# EAGLE design TSOP-Customized (EAGLE 9.0.1)
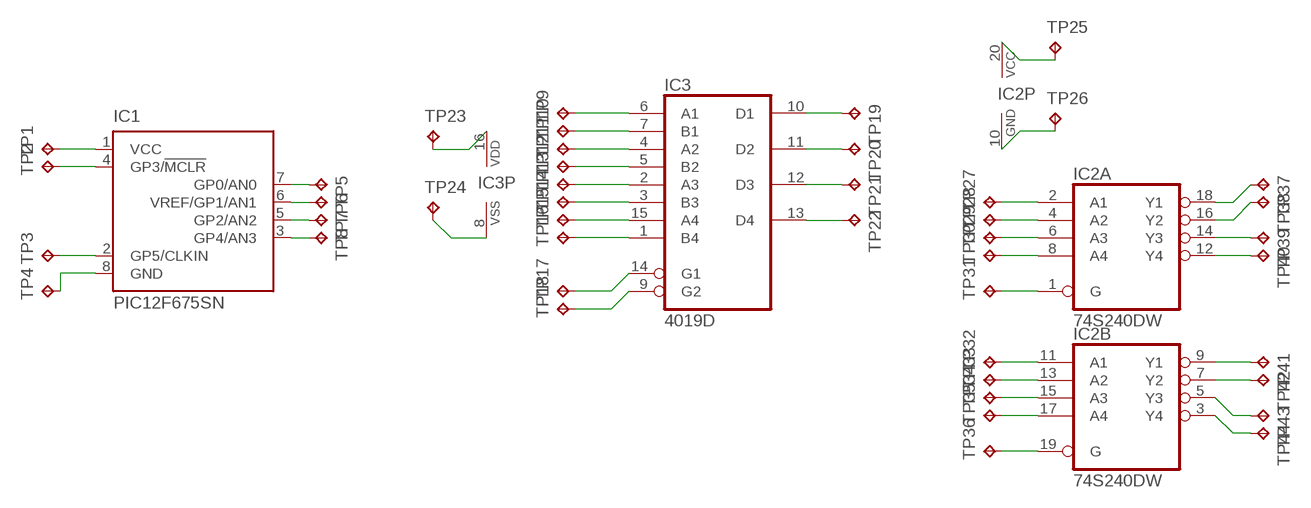
[diagram p0: schematic, sheet 1]

## Parts
IC1  PIC12F675SN  [SO-08]
IC2  74S240DW  [SO20W]
IC3  4019D  [SO16]
TP1  TPPAD1-13Y  [P1-13Y]
TP2  TPPAD1-13Y  [P1-13Y]
TP3  TPPAD1-13Y  [P1-13Y]
TP4  TPPAD1-13Y  [P1-13Y]
TP5  TPPAD1-13Y  [P1-13Y]
TP6  TPPAD1-13Y  [P1-13Y]
TP7  TPPAD1-13Y  [P1-13Y]
TP8  TPPAD1-13Y  [P1-13Y]
TP9  TPPAD1-13Y  [P1-13Y]
TP10  TPPAD1-13Y  [P1-13Y]
TP11  TPPAD1-13Y  [P1-13Y]
TP12  TPPAD1-13Y  [P1-13Y]
TP13  TPPAD1-13Y  [P1-13Y]
TP14  TPPAD1-13Y  [P1-13Y]
TP15  TPPAD1-13Y  [P1-13Y]
TP16  TPPAD1-13Y  [P1-13Y]
TP17  TPPAD1-13Y  [P1-13Y]
TP18  TPPAD1-13Y  [P1-13Y]
TP19  TPPAD1-13Y  [P1-13Y]
TP20  TPPAD1-13Y  [P1-13Y]
TP21  TPPAD1-13Y  [P1-13Y]
TP22  TPPAD1-13Y  [P1-13Y]
TP23  TPPAD1-13Y  [P1-13Y]
TP24  TPPAD1-13Y  [P1-13Y]
TP25  TPPAD1-13Y  [P1-13Y]
TP26  TPPAD1-13Y  [P1-13Y]
TP27  TPPAD1-13Y  [P1-13Y]
TP28  TPPAD1-13Y  [P1-13Y]
TP29  TPPAD1-13Y  [P1-13Y]
TP30  TPPAD1-13Y  [P1-13Y]
TP31  TPPAD1-13Y  [P1-13Y]
TP32  TPPAD1-13Y  [P1-13Y]
TP33  TPPAD1-13Y  [P1-13Y]
TP34  TPPAD1-13Y  [P1-13Y]
TP35  TPPAD1-13Y  [P1-13Y]
TP36  TPPAD1-13Y  [P1-13Y]
TP37  TPPAD1-13Y  [P1-13Y]
TP38  TPPAD1-13Y  [P1-13Y]
TP39  TPPAD1-13Y  [P1-13Y]
TP40  TPPAD1-13Y  [P1-13Y]
TP41  TPPAD1-13Y  [P1-13Y]
TP42  TPPAD1-13Y  [P1-13Y]
TP43  TPPAD1-13Y  [P1-13Y]
TP44  TPPAD1-13Y  [P1-13Y]

## Nets
N$1: IC1.1(VCC) TP1.TP
N$2: IC1.4(GP3/!MCLR) TP2.TP
N$3: IC1.2(GP5/CLKIN) TP3.TP
N$4: IC1.8(GND) TP4.TP
N$5: IC1.3(GP4/AN3) TP8.TP
N$6: IC1.5(GP2/AN2) TP7.TP
N$7: IC1.6(VREF/GP1/AN1) TP6.TP
N$8: IC1.7(GP0/AN0) TP5.TP
N$9: IC3.6(A1) TP9.TP
N$10: IC3.7(B1) TP10.TP
N$11: IC3.4(A2) TP11.TP
N$12: IC3.5(B2) TP12.TP
N$13: IC3.2(A3) TP13.TP
N$14: IC3.3(B3) TP14.TP
N$15: IC3.15(A4) TP15.TP
N$16: IC3.1(B4) TP16.TP
N$17: IC3.14(G1) TP17.TP
N$18: IC3.9(G2) TP18.TP
N$19: IC3.13(D4) TP22.TP
N$20: IC3.12(D3) TP21.TP
N$21: IC3.11(D2) TP20.TP
N$22: IC3.10(D1) TP19.TP
N$23: IC3.8(VSS) TP24.TP
N$24: IC3.16(VDD) TP23.TP
N$25: IC2.2(A:A1) TP27.TP
N$26: IC2.4(A:A2) TP28.TP
N$27: IC2.6(A:A3) TP29.TP
N$28: IC2.8(A:A4) TP30.TP
N$29: IC2.1(A:G) TP31.TP
N$30: IC2.11(B:A1) TP32.TP
N$31: IC2.13(B:A2) TP33.TP
N$32: IC2.15(B:A3) TP34.TP
N$33: IC2.17(B:A4) TP35.TP
N$34: IC2.19(B:G) TP36.TP
N$35: IC2.20(P:VCC) TP25.TP
N$36: IC2.10(P:GND) TP26.TP
N$37: IC2.18(A:Y1) TP37.TP
N$38: IC2.16(A:Y2) TP38.TP
N$39: IC2.14(A:Y3) TP39.TP
N$40: IC2.12(A:Y4) TP40.TP
N$41: IC2.9(B:Y1) TP41.TP
N$42: IC2.7(B:Y2) TP42.TP
N$43: IC2.5(B:Y3) TP43.TP
N$44: IC2.3(B:Y4) TP44.TP

## Library data of the parts
IC1 = microchip:PIC12F675: 8-Pin FLASH-Based 8-Bit CMOS Microcontroller Precision Internal 4 MHz oscillator factory calibrated to ±1% Low Power Features: Standby Current: - 1 nA @ 2.0V, typical Operating Current: - 8.5µA @ 32 kHz, 2.0V, typical - 100µA @ 1 MHz, 2.0V, typical Watchdog Timer Current: - 300 nA @ 2.0V, typical Timer1 oscillator current: - 4µA @ 32 kHz, 2.0V, typical Analog-to-Digital Converter module: - 10-bit resolution - Programmable 4-channel input - Voltage reference input Source: http://www.microchip.com .. 41190E.pdf; MF: MICROCHIP; MPN: PIC12F675-E/SN; OC_FARNELL: 9759026; OC_NEWARK: 92C4341
IC2 = 74xx-eu:74*240: Octal BUFFER and LINE DRIVER, 3-state
IC3 = 40xx:4019: Quad AND-OR select gate
TP1-TP44 = testpad:TP: Test pad

## Board
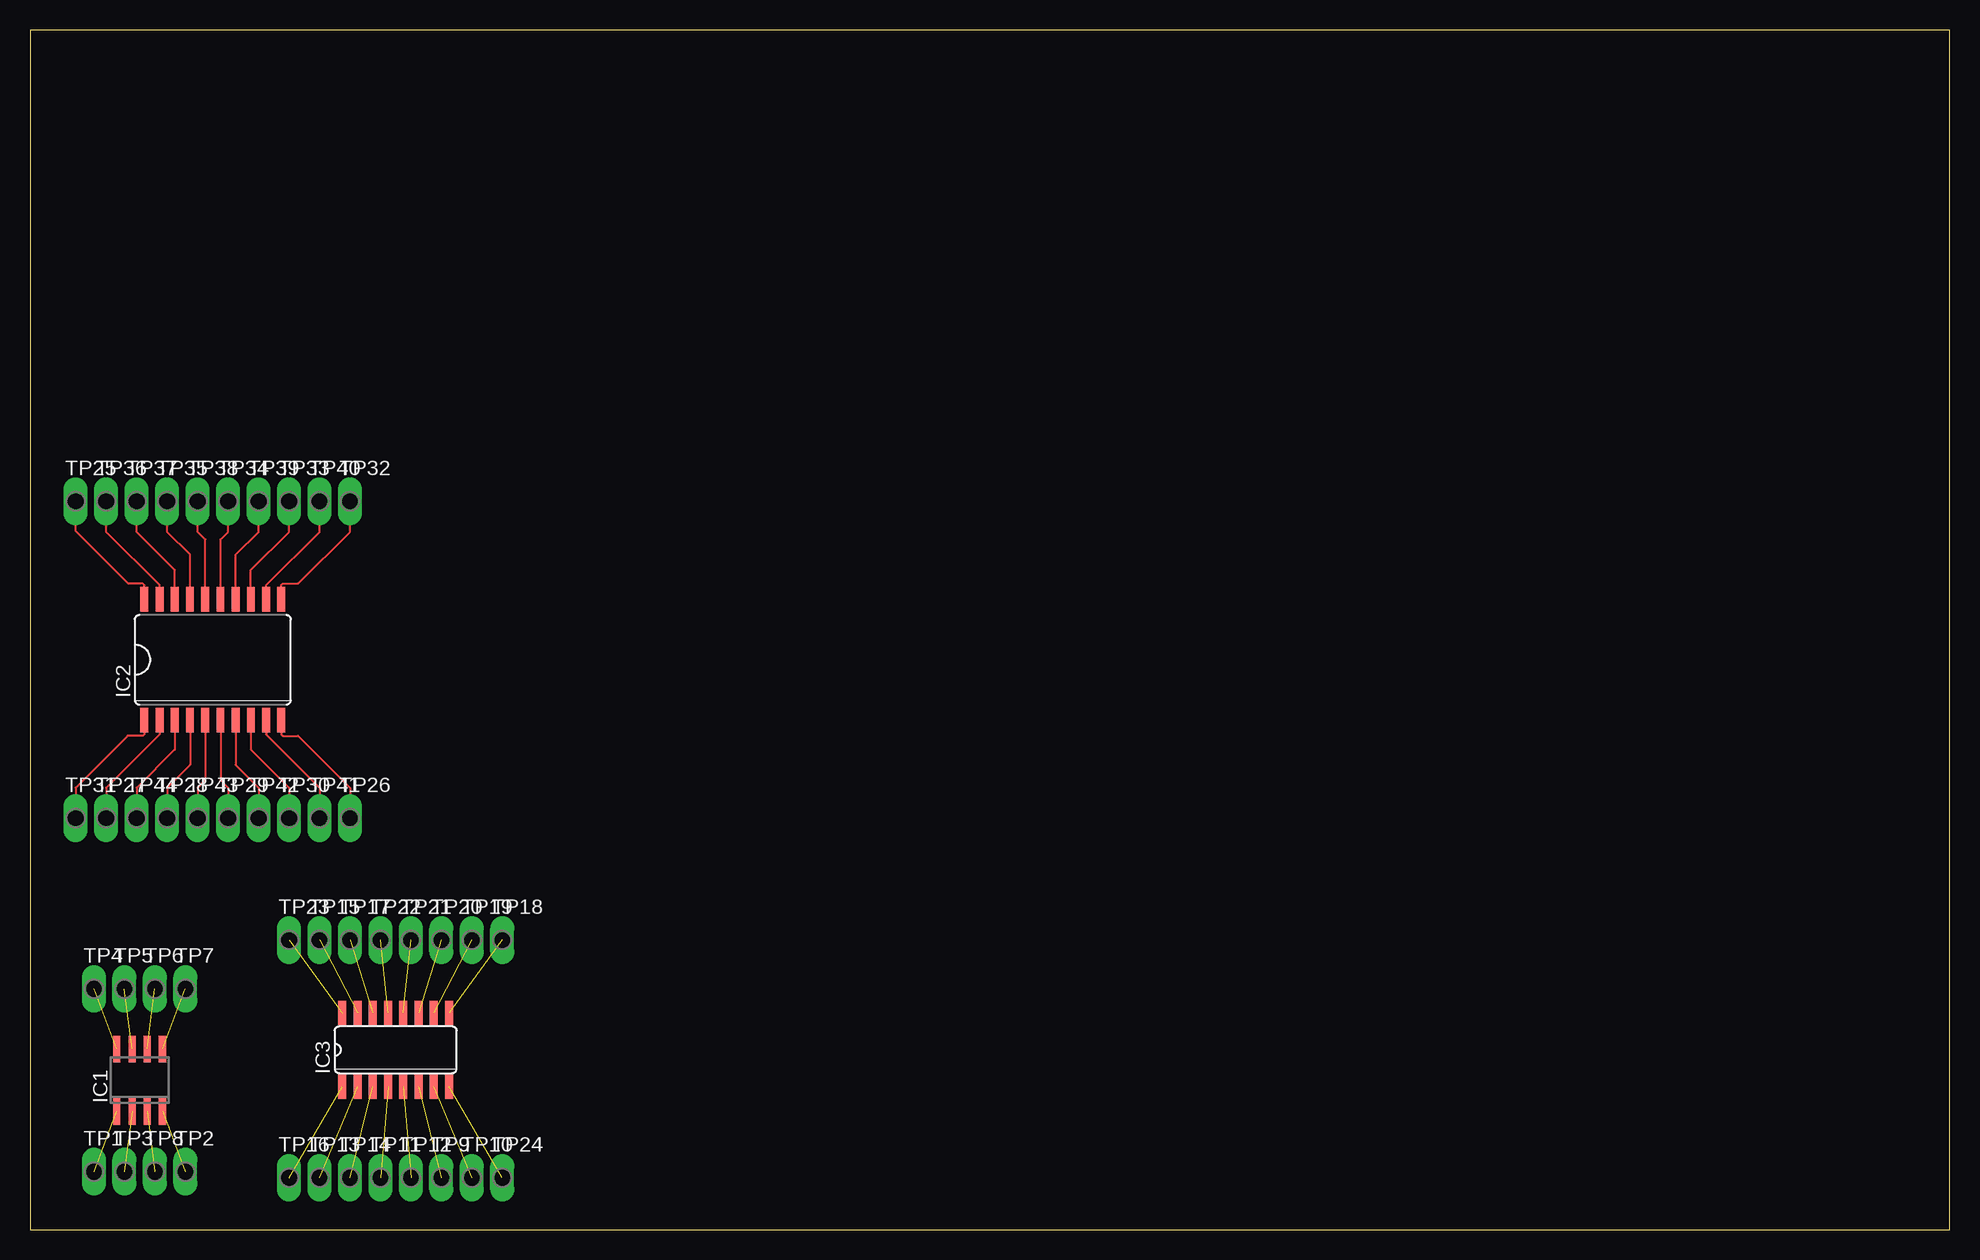
[diagram p1: board, top side]

Size 160 x 100 mm. Coordinates in mm from the lower left corner, seen from the top.
Outline: 0,0 160,0 160,100 0,100 0,0
Copper layers (1*16): Top 0.035mm / dielectric 1.5mm / Bottom 0.035mm
Design rules "default": minimum track width 6mil, minimum drill 0.35mm, track to track 6mil, track to pad 6mil, pad to pad 6mil, via to via 6mil, smd to smd 6mil, copper to edge 40mil, drill to drill 6mil, minimum pad ring 10mil, minimum via ring 8mil, stop-mask expansion 4mil, vias tented up to drill 0mil, thermal gap 10mil

### Footprints (pad centres in the part's own frame; a part is rotated, then mirrored left to right if it is on the bottom)
SO-08 = smd 0.6 x 2.2: 1 -1.905,-2.6; 2 -0.635,-2.6; 3 0.635,-2.6; 4 1.905,-2.6; 5 1.905,2.6; 6 0.635,2.6; 7 -0.635,2.6; 8 -1.905,2.6
SO20W = smd 0.66 x 2.032: 1 -5.715,-5.029; 2 -4.445,-5.029; 3 -3.175,-5.029; 4 -1.905,-5.029; 5 -0.635,-5.029; 6 0.635,-5.029; 7 1.905,-5.029; 8 3.175,-5.029; 9 4.445,-5.029; 10 5.715,-5.029; 11 5.715,5.029; 12 4.445,5.029; 13 3.175,5.029; 14 1.905,5.029; 15 0.635,5.029; 16 -0.635,5.029; 17 -1.905,5.029; 18 -3.175,5.029; 19 -4.445,5.029; 20 -5.715,5.029
SO16 = smd 0.66 x 2.032: 1 -4.445,-3.073; 2 -3.175,-3.073; 3 -1.905,-3.073; 4 -0.635,-3.073; 5 0.635,-3.073; 6 1.905,-3.073; 7 3.175,-3.073; 8 4.445,-3.073; 9 4.445,3.073; 10 3.175,3.073; 11 1.905,3.073; 12 0.635,3.073; 13 -0.635,3.073; 14 -1.905,3.073; 15 -3.175,3.073; 16 -4.445,3.073
P1-13Y = drill 1.321 pad 1.905 long: TP 0,0

### Placement (x,y rotation side)
IC1  9.14,12.45 0 top
IC2  15.24,47.5 0 top
IC3  30.48,14.99 0 top
TP1  5.33,4.83 0 top
TP2  12.95,4.83 0 top
TP3  7.87,4.83 0 top
TP4  5.33,20.07 0 top
TP5  7.87,20.07 0 top
TP6  10.41,20.07 0 top
TP7  12.95,20.07 0 top
TP8  10.41,4.83 0 top
TP9  34.29,4.32 0 top
TP10  36.83,4.32 0 top
TP11  29.21,4.32 0 top
TP12  31.75,4.32 0 top
TP13  24.13,4.32 0 top
TP14  26.67,4.32 0 top
TP15  24.13,24.13 0 top
TP16  21.59,4.32 0 top
TP17  26.67,24.13 0 top
TP18  39.37,24.13 0 top
TP19  36.83,24.13 0 top
TP20  34.29,24.13 0 top
TP21  31.75,24.13 0 top
TP22  29.21,24.13 0 top
TP23  21.59,24.13 0 top
TP24  39.37,4.32 0 top
TP25  3.81,60.71 0 top
TP26  26.67,34.29 0 top
TP27  6.35,34.29 0 top
TP28  11.43,34.29 0 top
TP29  16.51,34.29 0 top
TP30  21.59,34.29 0 top
TP31  3.81,34.29 0 top
TP32  26.67,60.71 0 top
TP33  21.59,60.71 0 top
TP34  16.51,60.71 0 top
TP35  11.43,60.71 0 top
TP36  6.35,60.71 0 top
TP37  8.89,60.71 0 top
TP38  13.97,60.71 0 top
TP39  19.05,60.71 0 top
TP40  24.13,60.71 0 top
TP41  24.13,34.29 0 top
TP42  19.05,34.29 0 top
TP43  13.97,34.29 0 top
TP44  8.89,34.29 0 top

### Tracks (layer width: path | path; a pad name or v marks a point on that pad's centre or on a via)
N$1  (1 unrouted)
N$2  (1 unrouted)
N$3  (1 unrouted)
N$4  (1 unrouted)
N$5  (1 unrouted)
N$6  (1 unrouted)
N$7  (1 unrouted)
N$8  (1 unrouted)
N$9  (1 unrouted)
N$10  (1 unrouted)
N$11  (1 unrouted)
N$12  (1 unrouted)
N$13  (1 unrouted)
N$14  (1 unrouted)
N$15  (1 unrouted)
N$16  (1 unrouted)
N$17  (1 unrouted)
N$18  (1 unrouted)
N$19  (1 unrouted)
N$20  (1 unrouted)
N$21  (1 unrouted)
N$22  (1 unrouted)
N$23  (1 unrouted)
N$24  (1 unrouted)
N$25
  Top 0.152: IC2.2 10.79,41.27 6.35,36.83 TP27.TP
N$26
  Top 0.152: IC2.4 13.34,38.73 11.43,36.83 TP28.TP
N$27
  Top 0.152: IC2.6 15.88,37.47 16.51,36.83 TP29.TP
N$28
  Top 0.152: IC2.8 18.41,40.01 21.59,36.83 TP30.TP
N$29
  Top 0.152: IC2.1 9.53,41.27 9.4,41.15 8.13,41.15 3.81,36.83 TP31.TP
N$30
  Top 0.152: IC2.11 20.95,53.72 21.08,53.85 22.35,53.85 26.67,58.17 TP32.TP
N$31
  Top 0.152: IC2.13 18.41,54.99 21.59,58.17 TP33.TP
N$32
  Top 0.152: IC2.15 15.88,57.53 16.51,58.17 TP34.TP
N$33
  Top 0.152: IC2.17 13.34,56.26 11.43,58.17 TP35.TP
N$34
  Top 0.152: IC2.19 10.79,53.72 6.35,58.17 TP36.TP
N$35
  Top 0.152: TP25.TP 3.81,58.24 8.2,53.85 9.4,53.85 9.53,53.72 IC2.20
N$36
  Top 0.152: IC2.10 20.95,41.27 21.08,41.15 22.35,41.15 26.67,36.83 TP26.TP
N$37
  Top 0.152: IC2.18 12.06,54.99 8.89,58.17 TP37.TP
N$38
  Top 0.152: IC2.16 14.61,57.53 13.97,58.17 TP38.TP
N$39
  Top 0.152: IC2.14 17.14,56.26 19.05,58.17 TP39.TP
N$40
  Top 0.152: IC2.12 19.68,53.72 24.13,58.17 TP40.TP
N$41
  Top 0.152: IC2.9 19.68,41.27 24.13,36.83 TP41.TP
N$42
  Top 0.152: IC2.7 17.14,38.73 19.05,36.83 TP42.TP
N$43
  Top 0.152: IC2.5 14.61,37.47 13.97,36.83 TP43.TP
N$44
  Top 0.152: IC2.3 12.06,40.01 8.89,36.83 TP44.TP